# Altium schematic sheet Positive_Rail.SchDoc: Positive Rails
size 420 x 297 mm; CheckedBy: G.Kasprowicz; DrawnBy: M.Gaska; Address1: PW ISE; Address2: Nowowiejska 15/19 00-665 Warsaw; Address3: michalgaska2@gmail.com; DocumentNumber: 3; SheetNumber: 6; SheetTotal: 9; EDA_Number: ARTIQ; Projet: AUX PSU; ModifiedBy: M. Fafara; CheckedDate: -; Title2: v2.0; DivGrp: WUT ISE; Designer: M.Gaska
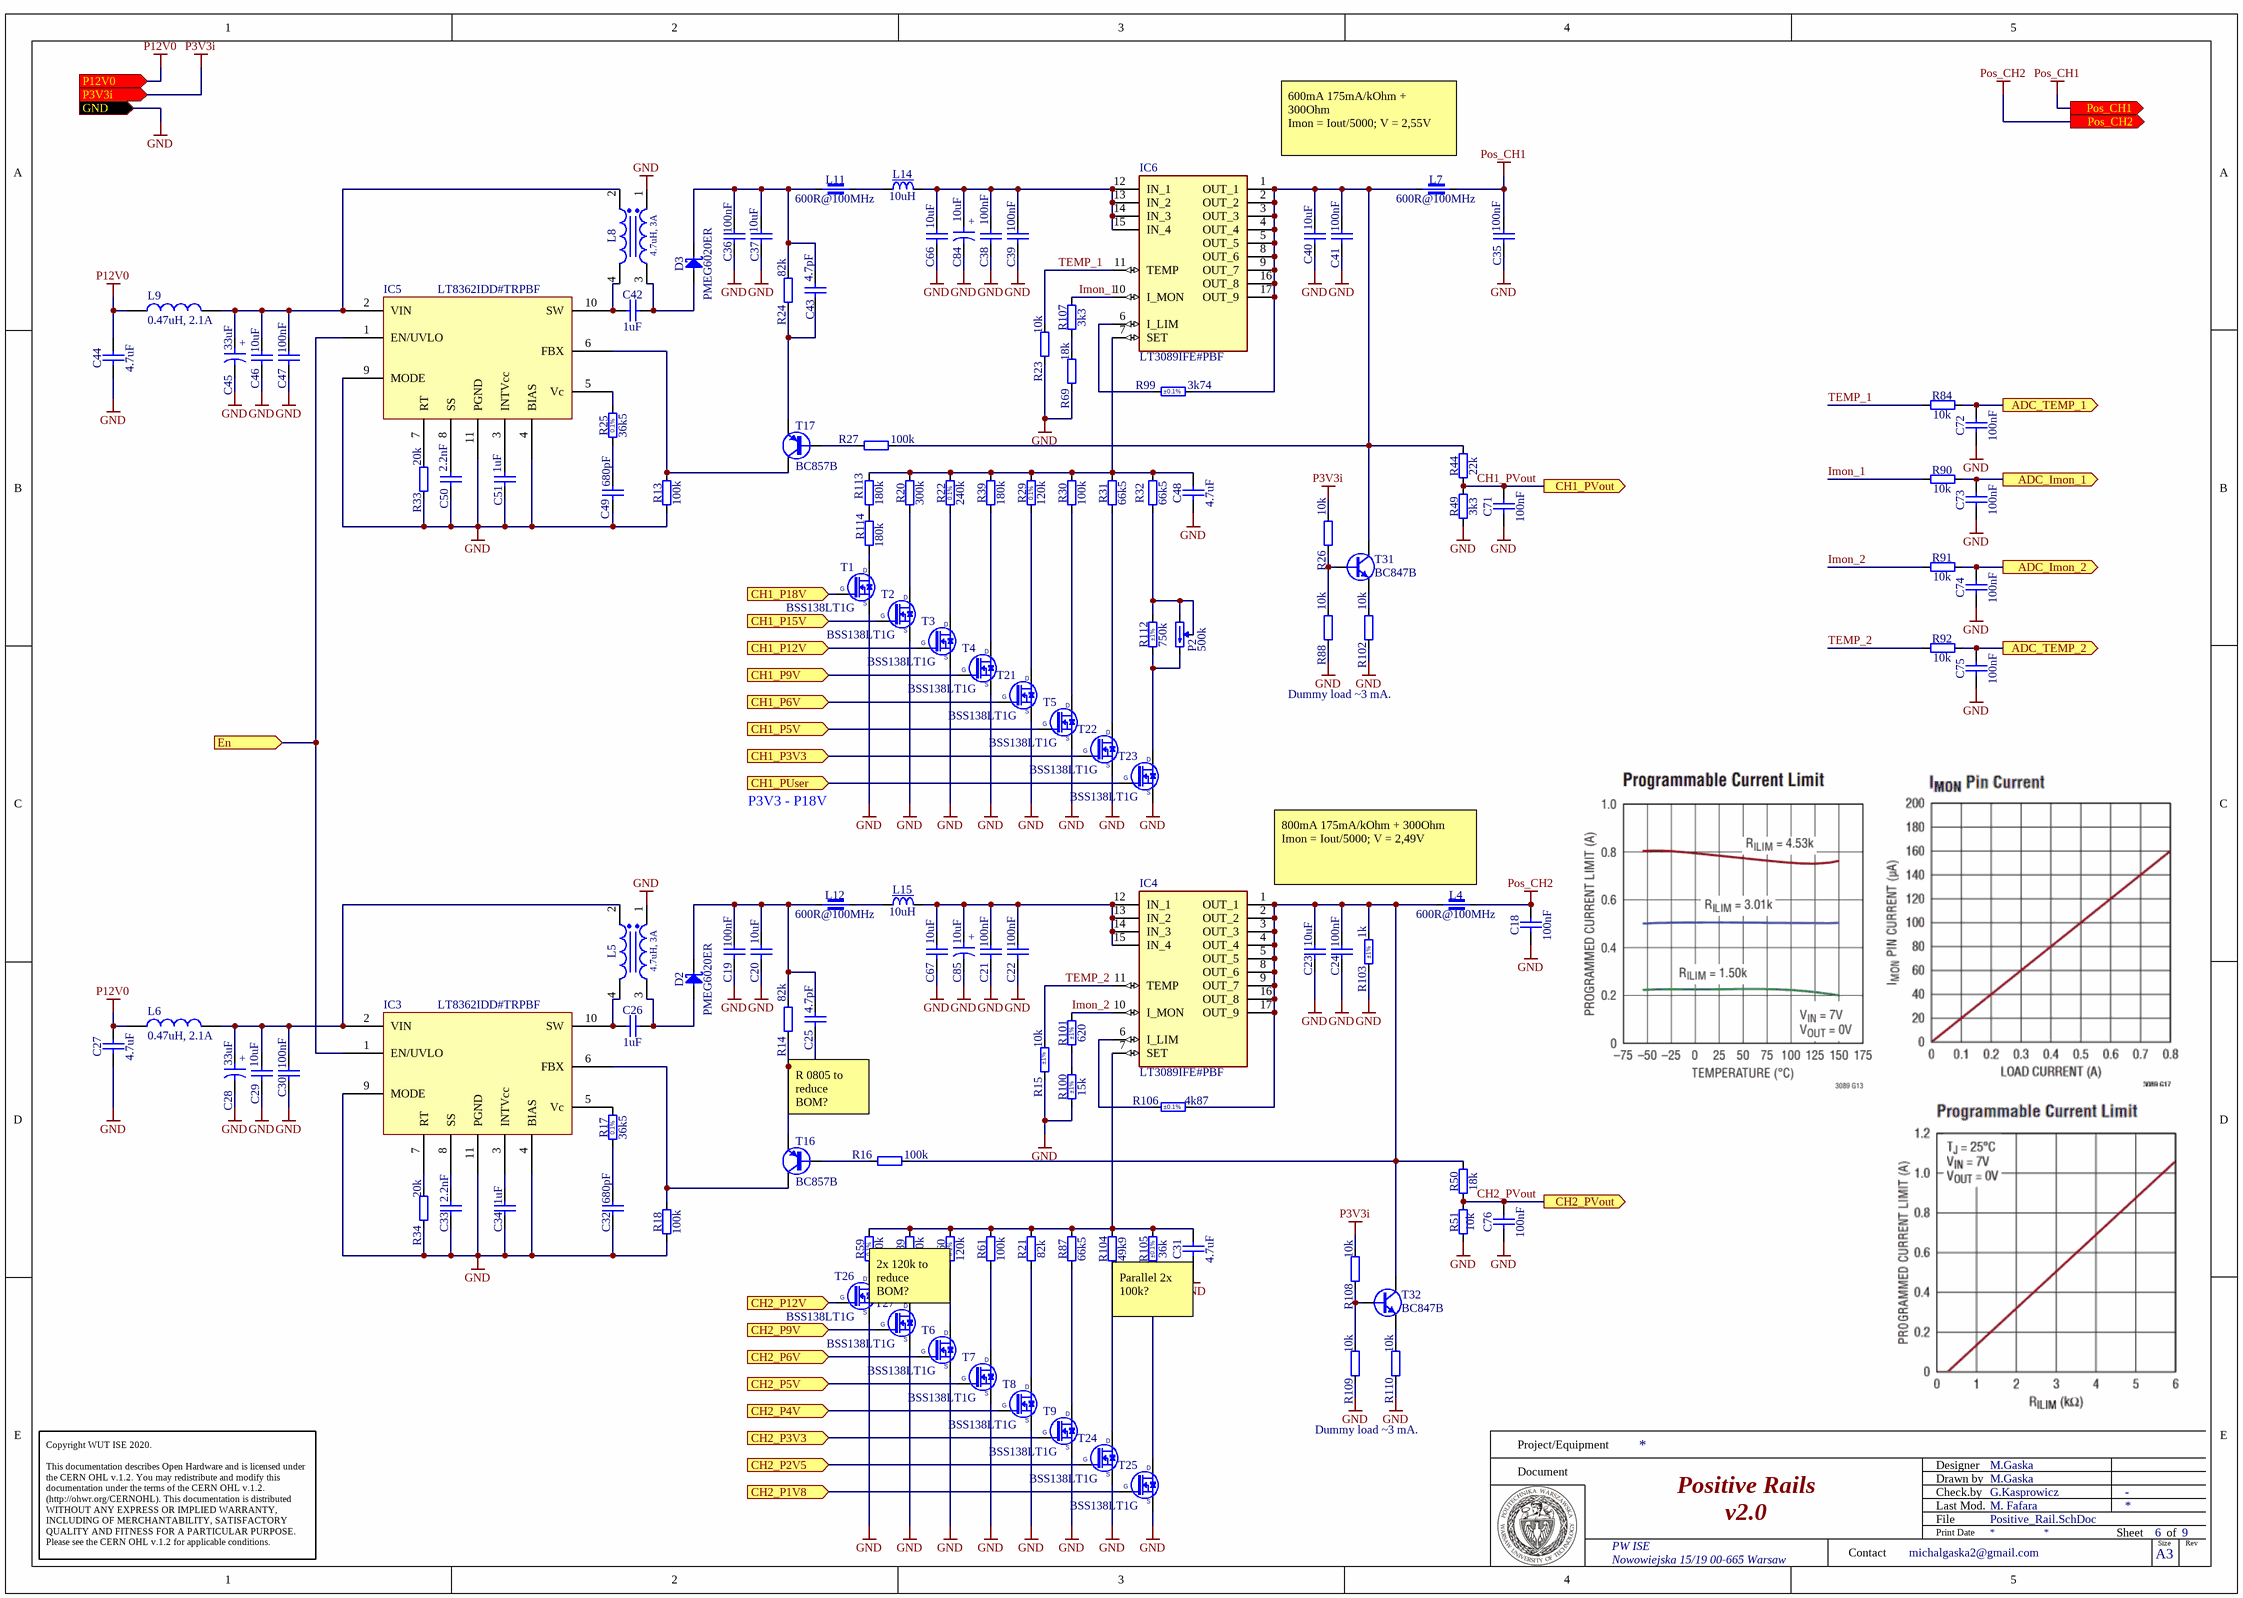
[diagram p0: Positive_Rail.SchDoc]

## Parts
C18  100nF  [CAPC1608X87N]
C19  100nF  [CAPC1608X87N]
C20  10uF  [CAPC3216X190N]
C21  100nF  [CAPC1608X87N]
C22  100nF  [CAPC1608X87N]
C23  10uF  [CAPC3216X190N]
C24  100nF  [CAPC1608X87N]
C25  4.7pF  [CAPC1608X87N]
C26  1uF  [CAPC3216X140N]
C27  4.7uF  [CAPC1608X90N]
C28  33uF  [CAPAE660X540N]
C29  10uF  [CAPC3216X190N]
C30  100nF  [CAPC1608X87N]
C31  4.7uF  [CAPC1608X90N]
C32  680pF  [CAPC1608X87N]
C33  2.2nF  [CAPC1005X55N]
C34  1uF  [CAPC1608X87N]
C35  100nF  [CAPC1608X87N]
C36  100nF  [CAPC1608X87N]
C37  10uF  [CAPC3216X190N]
C38  100nF  [CAPC1608X87N]
C39  100nF  [CAPC1608X87N]
C40  10uF  [CAPC3216X190N]
C41  100nF  [CAPC1608X87N]
C42  1uF  [CAPC3216X140N]
C43  4.7pF  [CAPC1608X87N]
C44  4.7uF  [CAPC1608X90N]
C45  33uF  [CAPAE660X540N]
C46  10uF  [CAPC3216X190N]
C47  100nF  [CAPC1608X87N]
C48  4.7uF  [CAPC1608X90N]
C49  680pF  [CAPC1608X87N]
C50  2.2nF  [CAPC1005X55N]
C51  1uF  [CAPC1608X87N]
C66  10uF  [CAPC3216X190N]
C67  10uF  [CAPC3216X190N]
C71  100nF  [CAPC1608X87N]
C72  100nF  [CAPC1608X87N]
C73  100nF  [CAPC1608X87N]
C74  100nF  [CAPC1608X87N]
C75  100nF  [CAPC1608X87N]
C76  100nF  [CAPC1608X87N]
C84  10uF  [CAPMP6032X280N]
C85  10uF  [CAPMP6032X280N]
D2  PMEG6020ER  [SODFL3517X110N]
D3  PMEG6020ER  [SODFL3517X110N]
IC3  LT8362IDD#TRPBF  [SON50P300X300X80-11N-R160X240]
IC4  LT3089IFE#PBF  [SOP65P640X110-17N]
IC5  LT8362IDD#TRPBF  [SON50P300X300X80-11N-R160X240]
IC6  LT3089IFE#PBF  [SOP65P640X110-17N]
L4  600R@100MHz  [INDC2012X110N]
L5  4.7uH, 3A  [WE-DD_1260]
L6  0.47uH, 2.1A  [WE-PMI_0806_H1]
L7  600R@100MHz  [INDC2012X110N]
L8  4.7uH, 3A  [WE-DD_1260]
L9  0.47uH, 2.1A  [WE-PMI_0806_H1]
L11  600R@100MHz  [INDC2012X110N]
L12  600R@100MHz  [INDC2012X110N]
L14  10uH  [IND_BOURNS_PM43]
L15  10uH  [IND_BOURNS_PM43]
P2  value 500k  [Bourns_3059Y]  (hidden comment: 3059Y-1-504LF)
R13  100k  [RESC1608X55N]
R14  82k  [RESC1608X55N]
R15  10k  Tolerance: ±1%  [RESC1608X55N]
R16  100k  [RESC1608X55N]
R17  36k5  [RESC1608X55N]
R18  100k  [RESC1608X55N]
R20  300k  [RESC2012X60N]
R21  82k  [RESC2012X60N]
R22  240k  [RESC2012X60N]
R23  10k  [RESC1608X55N]
R24  82k  [RESC1608X55N]
R25  36k5  [RESC1608X55N]
R26  10k  [RESC1608X55N]
R27  100k  [RESC1608X55N]
R29  120k  [RESC2012X60N]
R30  100k  [RESC2012X60N]
R31  66k5  [RESC2012X60N]
R32  66k5  [RESC2012X60N]
R33  20k  [RESC1608X55N]
R34  20k  [RESC1608X55N]
R39  180k  [RESC2012X60N]
R44  22k  [RESC1608X55N]
R49  3k3  [RESC1608X55N]
R50  18k  [RESC1608X55N]
R51  10k  [RESC1608X55N]
R59  240k  [RESC2012X60N]
R60  120k  [RESC2012X60N]
R61  100k  [RESC2012X60N]
R69  18k  [RESC1608X55N]
R84  10k  [RESC1608X55N]
R87  66k5  [RESC2012X60N]
R88  10k  [RESC1608X55N]
R89  180k  [RESC2012X60N]
R90  10k  [RESC1608X55N]
R91  10k  [RESC1608X55N]
R92  10k  [RESC1608X55N]
R99  3k74  Tolerance: ±0.1%  [RESC1608X55N]
R100  15k  Tolerance: ±1%  [RESC1608X55N]
R101  620  Tolerance: ±1%  [RESC1608X55N]
R102  10k  [RESC1608X55N]
R103  1k  Tolerance: ±1%  [RESC3216X65N]
R104  49k9  [RESC2012X60N]
R105  36k  Tolerance: ±0.1%  [RESC2012X60N]
R106  4k87  Tolerance: ±0.1%  [RESC1608X55N]
R107  3k3  [RESC1608X55N]
R108  10k  [RESC1608X55N]
R109  10k  [RESC1608X55N]
R110  10k  [RESC1608X55N]
R112  750k  Tolerance: ±1%  [RESC2012X60N]
R113  180k  [RESC2012X60N]
R114  180k  [RESC2012X60N]
T1  BSS138LT1G  [SOT95P240X110-3N]
T2  BSS138LT1G  [SOT95P240X110-3N]
T3  BSS138LT1G  [SOT95P240X110-3N]
T4  BSS138LT1G  [SOT95P240X110-3N]
T5  BSS138LT1G  [SOT95P240X110-3N]
T6  BSS138LT1G  [SOT95P240X110-3N]
T7  BSS138LT1G  [SOT95P240X110-3N]
T8  BSS138LT1G  [SOT95P240X110-3N]
T9  BSS138LT1G  [SOT95P240X110-3N]
T16  BC857B  [SOT95P230X110-3N]
T17  BC857B  [SOT95P230X110-3N]
T21  BSS138LT1G  [SOT95P240X110-3N]
T22  BSS138LT1G  [SOT95P240X110-3N]
T23  BSS138LT1G  [SOT95P240X110-3N]
T24  BSS138LT1G  [SOT95P240X110-3N]
T25  BSS138LT1G  [SOT95P240X110-3N]
T26  BSS138LT1G  [SOT95P240X110-3N]
T27  BSS138LT1G  [SOT95P240X110-3N]
T31  BC847B  [SOT95P230X110-3N]
T32  BC847B  [SOT95P230X110-3N]

## Ports
ADC_Imon_1 (out), ADC_Imon_2 (out), ADC_TEMP_1 (out), ADC_TEMP_2 (out), CH1_P3V3 (in), CH1_P5V (in), CH1_P6V (in), CH1_P9V (in), CH1_P12V (in), CH1_P15V (in), CH1_P18V (in), CH1_PUser (in), CH1_PVout (out), CH2_P1V8 (in), CH2_P2V5 (in), CH2_P3V3 (in), CH2_P4V (in), CH2_P5V (in), CH2_P6V (in), CH2_P9V (in), CH2_P12V (in), CH2_PVout (out), En (in), GND (in), P3V3i (in), P12V0 (in), Pos_CH1 (out), Pos_CH2 (out)

## Nets
GND: C18.1 C19.1 C20.1 C21.1 C22.1 C23.1 C24.1 C27.1 C28.2 C29.1 C30.1 C31.1 C32.1 C33.1 C34.1 C35.1 C36.1 C37.1 C38.1 C39.1 C40.1 C41.1 C44.1 C45.2 C46.1 C47.1 C48.1 C49.1 C50.1 C51.1 C66.1 C67.1 C71.1 C72.1 C73.1 C74.1 C75.1 C76.1 C84.2 C85.2 IC3.4(BIAS) IC3.9(MODE) IC3.11(PGND) IC5.4(BIAS) IC5.9(MODE) IC5.11(PGND) L5.1 L8.1 R13.1 R15.1 R18.1 R23.1 R33.1 R34.1 R49.1 R51.1 R69.1 R88.1 R100.1 R102.1 R103.1 R109.1 R110.1 T1.2(S) T2.2(S) T3.2(S) T4.2(S) T5.2(S) T6.2(S) T7.2(S) T8.2(S) T9.2(S) T21.2(S) T22.2(S) T23.2(S) T24.2(S) T25.2(S) T26.2(S) T27.2(S) ; port GND
P3V3i: R26.2 R108.2 ; port P3V3i
P12V0: C27.2 C44.2 L6.1 L9.1 ; port P12V0
Pos_CH1: C35.2 L7.2 ; port Pos_CH1
Pos_CH2: C18.2 L4.2 ; port Pos_CH2
ADC_Imon_1: C73.2 R90.2 ; port ADC_Imon_1
ADC_Imon_2: C74.2 R91.2 ; port ADC_Imon_2
ADC_TEMP_1: C72.2 R84.2 ; port ADC_TEMP_1
ADC_TEMP_2: C75.2 R92.2 ; port ADC_TEMP_2
CH1_P3V3: T22.1(G) ; port CH1_P3V3
CH1_P5V: T5.1(G) ; port CH1_P5V
CH1_P6V: T21.1(G) ; port CH1_P6V
CH1_P9V: T4.1(G) ; port CH1_P9V
CH1_P12V: T3.1(G) ; port CH1_P12V
CH1_P15V: T2.1(G) ; port CH1_P15V
CH1_P18V: T1.1(G) ; port CH1_P18V
CH1_PUser: T23.1(G) ; port CH1_PUser
CH1_PVout: C71.2 R44.1 R49.2 ; port CH1_PVout
CH2_P1V8: T25.1(G) ; port CH2_P1V8
CH2_P2V5: T24.1(G) ; port CH2_P2V5
CH2_P3V3: T9.1(G) ; port CH2_P3V3
CH2_P4V: T8.1(G) ; port CH2_P4V
CH2_P5V: T7.1(G) ; port CH2_P5V
CH2_P6V: T6.1(G) ; port CH2_P6V
CH2_P9V: T27.1(G) ; port CH2_P9V
CH2_P12V: T26.1(G) ; port CH2_P12V
CH2_PVout: C76.2 R50.1 R51.2 ; port CH2_PVout
En: IC3.1(EN/UVLO) IC5.1(EN/UVLO) ; port En
Imon_1: IC6.10(I_MON) R90.1 R107.2
Imon_2: IC4.10(I_MON) R91.1 R101.2
TEMP_1: IC6.11(TEMP) R23.2 R84.1
TEMP_2: IC4.11(TEMP) R15.2 R92.1
NetC19_2: C19.2 C20.2 C25.2 D2.1(C) L12.1 R14.2
NetC21_2: C21.2 C22.2 C67.2 C85.1 IC4.12(IN_1) IC4.13(IN_2) IC4.14(IN_3) IC4.15(IN_4) L15.2
NetC23_2: C23.2 C24.2 IC4.1(OUT_1) IC4.2(OUT_2) IC4.3(OUT_3) IC4.4(OUT_4) IC4.5(OUT_5) IC4.8(OUT_6) IC4.9(OUT_7) IC4.16(OUT_8) IC4.17(OUT_9) L4.1 R16.2 R50.2 R103.2 R106.2 T32.3(C)
NetC25_1: C25.1 R14.1 T16.2(E)
NetC26_1: C26.1 IC3.10(SW) L5.4
NetC26_2: C26.2 D2.2(A) L5.3
NetC28_1: C28.1 C29.2 C30.2 IC3.2(VIN) L5.2 L6.2
NetC31_2: C31.2 IC4.7(SET) R21.2 R59.2 R60.2 R61.2 R87.2 R89.2 R104.2 R105.2
NetC32_2: C32.2 R17.1
NetC33_2: C33.2 IC3.8(SS)
NetC34_2: C34.2 IC3.3(INTVcc)
NetC36_2: C36.2 C37.2 C43.2 D3.1(C) L11.1 R24.2
NetC38_2: C38.2 C39.2 C66.2 C84.1 IC6.12(IN_1) IC6.13(IN_2) IC6.14(IN_3) IC6.15(IN_4) L14.2
NetC40_2: C40.2 C41.2 IC6.1(OUT_1) IC6.2(OUT_2) IC6.3(OUT_3) IC6.4(OUT_4) IC6.5(OUT_5) IC6.8(OUT_6) IC6.9(OUT_7) IC6.16(OUT_8) IC6.17(OUT_9) L7.1 R27.2 R44.2 R99.2 T31.3(C)
NetC42_1: C42.1 IC5.10(SW) L8.4
NetC42_2: C42.2 D3.2(A) L8.3
NetC43_1: C43.1 R24.1 T17.2(E)
NetC45_1: C45.1 C46.2 C47.2 IC5.2(VIN) L8.2 L9.2
NetC48_2: C48.2 IC6.7(SET) R20.2 R22.2 R29.2 R30.2 R31.2 R32.2 R39.2 R113.2
NetC49_2: C49.2 R25.1
NetC50_2: C50.2 IC5.8(SS)
NetC51_2: C51.2 IC5.3(INTVcc)
NetIC3_5: IC3.5(Vc) R17.2
NetIC3_6: IC3.6(FBX) R18.2 T16.3(C)
NetIC3_7: IC3.7(RT) R34.2
NetIC4_6: IC4.6(I_LIM) R106.1
NetIC5_5: IC5.5(Vc) R25.2
NetIC5_6: IC5.6(FBX) R13.2 T17.3(C)
NetIC5_7: IC5.7(RT) R33.2
NetIC6_6: IC6.6(I_LIM) R99.1
NetL11_2: L11.2 L14.1
NetL12_2: L12.2 L15.1
NetP2_1: P2.1(CCW) P2.2(W) R32.1 R112.2
NetP2_3: P2.3(CW) R112.1 T23.3(D)
NetR16_1: R16.1 T16.1(B)
NetR20_1: R20.1 T2.3(D)
NetR21_1: R21.1 T8.3(D)
NetR22_1: R22.1 T3.3(D)
NetR26_1: R26.1 R88.2 T31.1(B)
NetR27_1: R27.1 T17.1(B)
NetR29_1: R29.1 T21.3(D)
NetR30_1: R30.1 T5.3(D)
NetR31_1: R31.1 T22.3(D)
NetR39_1: R39.1 T4.3(D)
NetR59_1: R59.1 T26.3(D)
NetR60_1: R60.1 T6.3(D)
NetR61_1: R61.1 T7.3(D)
NetR69_2: R69.2 R107.1
NetR87_1: R87.1 T9.3(D)
NetR89_1: R89.1 T27.3(D)
NetR100_2: R100.2 R101.1
NetR102_2: R102.2 T31.2(E)
NetR104_1: R104.1 T24.3(D)
NetR105_1: R105.1 T25.3(D)
NetR108_1: R108.1 R109.2 T32.1(B)
NetR110_2: R110.2 T32.2(E)
NetR113_1: R113.1 R114.1
NetR114_2: R114.2 T1.3(D)

## Notes on the sheet
- 600mA 175mA/kOhm + 300Ohm
  Imon = Iout/5000; V = 2,55V
- Dummy load ~3 mA.
- P3V3 - P18V
- 800mA 175mA/kOhm + 300Ohm
  Imon = Iout/5000; V = 2,49V
- R 0805 to reduce BOM?
- 2x 120k to reduce BOM?
- Parallel 2x 100k?
- Project/Equipment
- Document
- Designer
- Drawn by
- Check.by
- Copyright WUT ISE 2020.
  This documentation describes Open Hardware and is licensed under the CERN OHL v.1.2. You may redistribute and modify this documentation under the terms of the CERN OHL v.1.2. (http://ohwr.org/CERNOHL). This documentation is distributed WITHOUT ANY EXPRESS OR IMPLIED WARRANTY, INCLUDING OF MERCHANTABILITY, SATISFACTORY QUALITY AND FITNESS FOR A PARTICULAR PURPOSE. Please see the CERN OHL v.1.2 for applicable conditions.
- Contact
- File
- Last Mod.
- Print Date
- Sheet
- Size
- A3
- of
- Rev
- (in symbol CAE660-540_33UF_35V_20%) +
- (in symbol CTE6032-28_10UF_25V_10%_LESR0500) +
- (in symbol R0603_36K5_0.1%_0.063W_10PPM) 0.1%
- (in symbol R0805_120K_0.1%_0.125W_25PPM) 0.1%
- (in symbol R0805_240K_0.1%_0.1W_10PPM) 0.1%

## Library data of the parts
C18 C19 C21 C22 C24 C30 C35 C36 C38 C39 C41 C47 C71-C76 = CC0603_100NF_50V_10%_X5R: Non-polarised capacitor; Part Description: SMD Multilayer Chip Ceramic Capacitor; Manufacturer: GENERIC; Manufacturer1 Part Number: C1608X5R1H104K080; Voltage: 50V; TC: X5R; Tolerance: ±10%; Part Number: CC0603_100NF_50V_10%_X5R; Component Kind: Standard; Component Type: Standard; Pin Count: 2; Value: 100nF; Status: None; Manufacturer Part Number: CC0603_100NF_50V_10%_X5R; Case: 0603; Mounted: Yes; Socket: No; SMD: Yes; Sense: No; Manufacturer1 Example: TDK; Manufacturer1 ComponentHeight: 0.9mm; HelpURL: \\cern.ch\dfs\Applications\Altium\Datasheets\CC0603_X5R_TDK_C.pdf; Author: CERN DEM MR; CreateDate: 08.01.2016; LatestRevisionDate: 08.01.2016
C20 C23 C29 C37 C40 C46 C66 C67 = CC1206_10UF_35V_10%_X7R_YUDEN_GMJ316BB7106KLHT: Non-polarised capacitor; Part Description: Soft Termination SMD Multilayer Chip Ceramic Capacitor for Automotive / Industrial Applications; Manufacturer: TAIYO YUDEN; Voltage: 35V; TC: X7R; Tolerance: ±10%; Status Comment: for Not Designs; Part Number: CC1206_10UF_35V_10%_X7R_YUDEN_GMJ316BB7106KLHT; Component Kind: Standard; Component Type: Standard; Pin Count: 2; Value: 10uF; Status: Not Recommended; Manufacturer Part Number: GMJ316BB7106KLHT; Case: 1206; Mounted: Yes; Socket: No; SMD: Yes; Sense: No; ComponentHeight: 1.90mm; HelpURL: \\cern.ch\dfs\Applications\Altium\Datasheets\CC1206_TAIYO-YUDEN_GMJ316BB7106KLHT.pdf; Author: CERN DEM BC; CreateDate: 26.02.2016; LatestRevisionDate: 17.12.2018
C25 C43 = CC0603_4.7PF_50V_0.25PF_NP0: Non-polarised capacitor; Part Description: SMD Multilayer Chip Ceramic Capacitor; Manufacturer: GENERIC; Manufacturer1 Part Number: 223886715478; Voltage: 50V; TC: C0G/NP0; Tolerance: ±0.25pF; Part Number: CC0603_4.7PF_50V_0.25PF_NP0; Component Kind: Standard; Component Type: Standard; Pin Count: 2; Value: 4.7pF; Status: Preferred; Manufacturer Part Number: CC0603_4.7PF_50V_0.25PF_NP0; Case: 0603; Mounted: Yes; Socket: No; SMD: Yes; Sense: No; Manufacturer1 Example: PHYCOMP; Manufacturer1 ComponentHeight: 0.87mm; HelpURL: \\cern.ch\dfs\Applications\Altium\Datasheets\CC0603_NP0_PHYCOMP.pdf; Author: CERN DEM JLC; CreateDate: 03.12.2007; LatestRevisionDate: 03.12.2007
C26 C42 = CC1206_1UF_100V_10%_X7R: Non-polarised capacitor; Part Description: SMD Multilayer Chip Ceramic Capacitor; Manufacturer: GENERIC; Manufacturer1 Part Number: C1206C105K1RAC; Voltage: 100V; TC: X7R; Tolerance: ±10%; Part Number: CC1206_1UF_100V_10%_X7R; Component Kind: Standard; Component Type: Standard; Pin Count: 2; Value: 1uF; Status: Preferred; Manufacturer Part Number: CC1206_1UF_100V_10%_X7R; Case: 1206; Mounted: Yes; Socket: No; SMD: Yes; Sense: No; Manufacturer1 Example: KEMET; Manufacturer1 ComponentHeight: 1.8mm; HelpURL: \\cern.ch\dfs\Applications\Altium\Datasheets\CC1206_X7R_KEMET_OPENMODE.pdf; Author: CERN DEM BC; CreateDate: 24.01.2020; LatestRevisionDate: 24.01.2020
C27 C31 C44 C48 = CC0603_4.7UF_25V_10%_X5R: Non-polarised capacitor; Part Description: SMD Multilayer Chip Ceramic Capacitor; Manufacturer: GENERIC; Manufacturer1 Part Number: GRM188R61E475KE11D; Voltage: 25V; TC: X5R; Tolerance: ±10%; Part Number: CC0603_4.7UF_25V_10%_X5R; Component Kind: Standard; Component Type: Standard; Pin Count: 2; Value: 4.7uF; Status: None; Manufacturer Part Number: CC0603_4.7UF_25V_10%_X5R; Case: 0603; Mounted: Yes; Socket: No; SMD: Yes; Sense: No; Manufacturer1 Example: MURATA; Manufacturer1 ComponentHeight: 0.95mm; HelpURL: \\cern.ch\dfs\Applications\Altium\Datasheets\CC0603_MURATA_GRM188R61E475KE11D.pdf; Author: CERN DEM JLC; CreateDate: 10.11.2014; LatestRevisionDate: 10.11.2014
C28 C45 = CAE660-540_33UF_35V_20%: Polarised capacitor; Part Description: Aluminum Electrolytic SMT Capacitor; Manufacturer: PANASONIC; Manufacturer Part Number: EEEFK1V330AP; Voltage: 35V; Tolerance: ±20%; Part Number: CAE660-540_33UF_35V_20%; Component Kind: Standard; Component Type: Standard; Pin Count: 2; Value: 33uF; Status: Not Recommended; Case: D; Mounted: Yes; Socket: No; SMD: Yes; Sense: No; ComponentHeight: 5.8mm; HelpURL: \\cern.ch\dfs\Applications\Altium\Datasheets\CAE_PANASONIC_FK-V.pdf; Author: CERN DEM JLC; CreateDate: 03.12.2007; LatestRevisionDate: 05.11.2014
C32 C49 = CC0603_680PF_50V_5%_NP0: Non-polarised capacitor; Part Description: SMD Multilayer Chip Ceramic Capacitor; Manufacturer: GENERIC; Manufacturer1 Part Number: 223886715681; Voltage: 50V; TC: C0G/NP0; Tolerance: ±5%; Part Number: CC0603_680PF_50V_5%_NP0; Component Kind: Standard; Component Type: Standard; Pin Count: 2; Value: 680pF; Status: Preferred; Manufacturer Part Number: CC0603_680PF_50V_5%_NP0; Case: 0603; Mounted: Yes; Socket: No; SMD: Yes; Sense: No; Manufacturer1 Example: PHYCOMP; Manufacturer1 ComponentHeight: 0.87mm; HelpURL: \\cern.ch\dfs\Applications\Altium\Datasheets\CC0603_NP0_PHYCOMP.pdf; Author: CERN DEM JLC; CreateDate: 03.12.2007; LatestRevisionDate: 03.12.2007
C33 C50 = CC0402_2.2NF_50V_10%_X7R: Non-polarised capacitor; Part Description: SMD Multilayer Chip Ceramic Capacitor; Manufacturer: GENERIC; Manufacturer1 Part Number: 223858715627; Voltage: 50V; TC: X7R; Tolerance: ±10%; Part Number: CC0402_2.2NF_50V_10%_X7R; Component Kind: Standard; Component Type: Standard; Pin Count: 2; Value: 2.2nF; Status: Not Recommended; Manufacturer Part Number: CC0402_2.2NF_50V_10%_X7R; Case: 0402; Mounted: Yes; Socket: No; SMD: Yes; Sense: No; Manufacturer1 Example: PHYCOMP; Manufacturer1 ComponentHeight: 0.55mm; HelpURL: \\cern.ch\dfs\Applications\Altium\Datasheets\CC0402_X7R_PHYCOMP.pdf; Author: CERN DEM JLC; CreateDate: 03.12.2007; LatestRevisionDate: 03.12.2007
C34 C51 = CC0603_1UF_16V_10%_X7R: Non-polarised capacitor; Part Description: SMD Multilayer Chip Ceramic Capacitor; Manufacturer: GENERIC; Manufacturer1 Part Number: 223878615663; Voltage: 16V; TC: X7R; Tolerance: ±10%; Part Number: CC0603_1UF_16V_10%_X7R; Component Kind: Standard; Component Type: Standard; Pin Count: 2; Value: 1uF; Status: None; Manufacturer Part Number: CC0603_1uF_16V_10%_X7R; Case: 0603; Mounted: Yes; Socket: No; SMD: Yes; Sense: No; Manufacturer1 Example: YAGEO PHYCOMP; Manufacturer1 ComponentHeight: 0.9mm; HelpURL: \\cern.ch\dfs\Applications\Altium\Datasheets\CC0603_X7R_PHYCOMP.pdf; Author: CERN DEM JLC; CreateDate: 03.12.2007; LatestRevisionDate: 17.04.2015
C84 C85 = CTE6032-28_10UF_25V_10%_LESR0500: Polarised capacitor; Part Description: Low ESR 0R5 Solid Tantalum Chip Capacitor; Manufacturer: GENERIC; Manufacturer1 Part Number: TPSC106K025R0500; Voltage: 25V; Tolerance: ±10%; Part Number: CTE6032-28_10UF_25V_10%_LESR0500; Component Kind: Standard; Component Type: Standard; Pin Count: 2; Value: 10uF; Status: Preferred; Manufacturer Part Number: CTE6032-28_10UF_25V_10%_LESR0500; Case: C; Mounted: Yes; Socket: No; SMD: Yes; Sense: No; Manufacturer1 Example: AVX; Manufacturer1 ComponentHeight: 2.8mm; HelpURL: \\cern.ch\dfs\Applications\Altium\Datasheets\CTE-LESR_AVX_TPS.pdf; Author: CERN DEM JLC; CreateDate: 05.05.2008; LatestRevisionDate: 20.01.2009
D2 D3 = PMEG6020ER: Schottky Diode; Part Description: MEGA Schottky Barrier Rectifier; Manufacturer: NXP SEMICONDUCTORS; Voltage: 60V; Power: 2A; PressFit: No; Bonding: No; Part Number: PMEG6020ER; Component Kind: Standard; Component Type: Standard; Device: PMEG6020ER; PackageDescription: SODFL Diode (SOD123W); 2.60mm W X 1.70mm L X 1.10mm H body, IPC Medium Density; Manufacturer Part Number: PMEG6020ER; Pin Count: 2; Case: SOD-123FL; Mounted: Yes; Socket: No; SMD: Yes; Sense: No; ComponentHeight: 1.1mm; HelpURL: \\cern.ch\dfs\Applications\Altium\Datasheets\PMEG6020ER.pdf; Author: CERN DEM JMW; CreateDate: 19.06.2014; LatestRevisionDate: 19.06.2014
IC4 IC6 = LT3089IFE#PBF: LDO Voltage Regulators 800mA 1x Res Rugged Lin Reg w/ Mon s; Manufacturer_Name: Analog Devices; Datasheet Link: https://datasheet.datasheetarchive.com/originals/distributors/DKDS-14/269811.pdf; Height: 1.1mm; Manufacturer Part Number: LT3089IFE#PBF; Mouser Part Number: 584-LT3089IFE#PBF; Mouser Price/Stock: https://www.mouser.co.uk/ProductDetail/Analog-Devices/LT3089IFEPBF?qs=oahfZPh6IAJK75iHT%252BsZQw%3D%3D; Arrow Part Number: LT3089IFE#PBF; Arrow Price/Stock: https://www.arrow.com/en/products/lt3089ifepbf/analog-devices?region=europe
L4 L7 L11 L12 = IND0805_WURTH_742792040: Part Description: SMD EMI Suppression Chip Ferrite Bead (WE-CBF Series); Manufacturer: WURTH ELEKTRONIK; Power: 2A; Resistance: 0.150R; Tolerance: ±25%; Part Number: IND0805_WURTH_742792040; Component Kind: Standard; Component Type: Standard; Pin Count: 2; Value: 600R@100MHz; Manufacturer Part Number: 742792040; Case: 0805; Mounted: Yes; Socket: No; SMD: Yes; Sense: No; ComponentHeight: 1.1mm; HelpURL: \\cern.ch\dfs\Applications\Altium\Datasheets\IND0805_WURTH_742792040.pdf; Author: CERN DEM JLC; CreateDate: 10.05.2010; LatestRevisionDate: 25.10.2018
L5 L8 = 744871004: WE-DD SMT Shielded Coupled Inductor, size 1260, 4.7uH, 3A; Manufacturer: Wurth Elektronik; Rated Voltage: 80V; DC Resistance max.: 28mOhm; Self Resonant Frequency: 20MHz; DC Resistance typ.: 23mOhm; Saturation Current: 8A; Turns Ratio: 1:1; Type: Crossed; ComponentLink1Description: Manufacturer; ComponentLink1URL: http://www.we-online.de; ComponentLink2Description: Datasheet; ComponentLink2URL: https://www.we-online.com/catalog/datasheet/744871004.pdf; Packaging: Tape and Reel; Published Date: April 2020; Rated Current: 3A; Operating Temperature: -40 to +125degC; Size: 1260; Inductance: 4.7uH; Mounting Technology: SMT; Manufacturer Part Number: 744871004
L6 L9 = 74479876147: WE-PMI Power Multilayer Inductor, size 0806, 0.47uH, 2.1A; Manufacturer: Wurth Elektronik; Q-Factor: 13; Saturation Current: 2A; DC Resistance max.: 50mOhm; Inductance Tolerance: +/-20%; Rated Current @20K: 1.5A; Self Resonant Frequency: 120MHz; Type: Low RDC & High Saturation Current; ComponentLink1Description: Manufacturer; ComponentLink1URL: http://www.we-online.de; ComponentLink2Description: Datasheet; ComponentLink2URL: https://www.we-online.com/catalog/datasheet/74479876147.pdf; Mounting Technology: SMT; Operating Temperature: -40 to +125degC; Packaging: Tape and Reel; Inductance: 0.47uH; Rated Current @40K: 2.1A; Manufacturer Part Number: 74479876147; Published Date: April 2020; Size: 0806
L14 L15 = IND_10UH_20%_BOURNS_PM43: Inductor With Core; Part Description: SMD Power Inductor; Manufacturer: BOURNS; Manufacturer Part Number: PM43-100M-RC; Power: 1.15A; Resistance: 0.18R; Tolerance: ±20%; Part Number: IND_10UH_20%_BOURNS_PM43; Component Kind: Standard; Component Type: Standard; Pin Count: 2; Value: 10uH; Mounted: Yes; Socket: No; SMD: Yes; Sense: No; ComponentHeight: 3.5mm; HelpURL: \\cern.ch\dfs\Applications\Altium\Datasheets\IND_BOURNS_PM43.pdf; Author: CERN DEM JLC; CreateDate: 17.05.2011; LatestRevisionDate: 17.05.2011
P2 = CMP-009-04017-1: Trimmer, Cermet, 1W, 500000ohm, 400V, 10% +/-Tol, 100ppm/Cel, 22 Turn(s); Mounting Technology: Through Hole; Max Operating Temperature: 150°C; RoHS Compliant: Yes; Min Operating Temperature: -55°C; Power: 1W; Pins: 3; Tolerance: 10%
R13 R16 R18 R27 = R0603_100K_1%_0.1W_100PPM: Resistor - 1%; Part Description: General Purpose Thick Film Chip Resistor; Manufacturer: GENERIC; Manufacturer1 Part Number: NRC06F1003TRF; Power: 0.1W; TC: ±100ppm/°C; PressFit: No; Part Number: R0603_100K_1%_0.1W_100PPM; Component Kind: Standard; Component Type: Standard; Pin Count: 2; Value: 100k; Status: Preferred; Tolerance: ±1%; Manufacturer Part Number: R0603_100K_1%_0.1W_100PPM; Case: 0603; Mounted: Yes; Sense: No; Socket: No; SMD: Yes; Manufacturer1 Example: NIC COMPONENT; Manufacturer1 ComponentHeight: 0.55mm; HelpURL: \\cern.ch\dfs\Applications\Altium\Datasheets\R0603_NIC_NRC.pdf; Author: CERN DEM JLC; CreateDate: 03.12.2007; LatestRevisionDate: 13.03.2008
R14 R24 = R0603_82K_1%_0.1W_100PPM: Resistor - 1%; Part Description: General Purpose Thick Film Chip Resistor; Manufacturer: GENERIC; Manufacturer1 Part Number: NRC06F8202TRF; Power: 0.1W; TC: ±100ppm/°C; PressFit: No; Part Number: R0603_82K_1%_0.1W_100PPM; Component Kind: Standard; Component Type: Standard; Pin Count: 2; Value: 82k; Status: Preferred; Tolerance: ±1%; Manufacturer Part Number: R0603_82K_1%_0.1W_100PPM; Case: 0603; Mounted: Yes; Sense: No; Socket: No; SMD: Yes; Manufacturer1 Example: NIC COMPONENT; Manufacturer1 ComponentHeight: 0.55mm; HelpURL: \\cern.ch\dfs\Applications\Altium\Datasheets\R0603_NIC_NRC.pdf; Author: CERN DEM JLC; CreateDate: 03.12.2007; LatestRevisionDate: 13.03.2008
R15 R23 R26 R51 R84 R88 R90-R92 R102 R108-R110 = R0603_10K_1%_0.1W_100PPM: Resistor - 1%; Part Description: General Purpose Thick Film Chip Resistor; Manufacturer: GENERIC; Manufacturer1 Part Number: NRC06F1002TRF; Power: 0.1W; TC: ±100ppm/°C; PressFit: No; Part Number: R0603_10K_1%_0.1W_100PPM; Component Kind: Standard; Component Type: Standard; Pin Count: 2; Value: 10k; Status: Preferred; Manufacturer Part Number: R0603_10K_1%_0.1W_100PPM; Case: 0603; Mounted: Yes; Sense: No; Socket: No; SMD: Yes; Manufacturer1 Example: NIC COMPONENT; Manufacturer1 ComponentHeight: 0.55mm; HelpURL: \\cern.ch\dfs\Applications\Altium\Datasheets\R0603_NIC_NRC.pdf; Author: CERN DEM JLC; CreateDate: 03.12.2007; LatestRevisionDate: 13.03.2008
  R23 R26 R51 R84 R88 R90-R92 R102 R108-R110: Tolerance: ±1%
R17 R25 = R0603_36K5_0.1%_0.063W_10PPM: Resistor - 0.1%; Part Description: Thin Film Chip Resistor; Manufacturer: GENERIC; Manufacturer1 Part Number: RN73C1J36K5BTDF; Power: 0.063W; TC: ±10ppm; PressFit: No; Part Number: R0603_36K5_0.1%_0.063W_10PPM; Component Kind: Standard; Component Type: Standard; Pin Count: 2; Value: 36k5; Status: Not Recommended; Tolerance: ±0.1%; Manufacturer Part Number: R0603_36K5_0.1%_0.063W_10PPM; Case: 0603; Mounted: Yes; Sense: No; Socket: No; SMD: Yes; Manufacturer1 Example: TYCO HOLSWORTHY; Manufacturer1 ComponentHeight: 0.5mm; HelpURL: \\cern.ch\dfs\Applications\Altium\Datasheets\R0603_Tyco_RN73.pdf; Author: CERN DEM JLC; CreateDate: 03.12.2007; LatestRevisionDate: 13.03.2008
R20 = R0805_300K_1%_0.125W_100PPM: Resistor - 1%; Part Description: General Purpose Thick Film Chip Resistor; Manufacturer: GENERIC; Manufacturer1 Part Number: NRC10F3003TRF; Power: 0.125W; TC: ±100ppm/°C; PressFit: No; Part Number: R0805_300K_1%_0.125W_100PPM; Component Kind: Standard; Component Type: Standard; Pin Count: 2; Value: 300k; Status: Preferred; Tolerance: ±1%; Manufacturer Part Number: R0805_300K_1%_0.125W_100PPM; Case: 0805; Mounted: Yes; Sense: No; Socket: No; SMD: Yes; Manufacturer1 Example: NIC COMPONENT; Manufacturer1 ComponentHeight: 0.6mm; HelpURL: \\cern.ch\dfs\Applications\Altium\Datasheets\R0805_NIC_NRC.pdf; Author: CERN DEM JLC; CreateDate: 03.12.2007; LatestRevisionDate: 13.03.2008
R21 = R0805_82K_1%_0.125W_100PPM: Resistor - 1%; Part Description: General Purpose Thick Film Chip Resistor; Manufacturer: GENERIC; Manufacturer1 Part Number: NRC10F8202TRF; Power: 0.125W; TC: ±100ppm/°C; PressFit: No; Part Number: R0805_82K_1%_0.125W_100PPM; Component Kind: Standard; Component Type: Standard; Pin Count: 2; Value: 82k; Status: Preferred; Tolerance: ±1%; Manufacturer Part Number: R0805_82K_1%_0.125W_100PPM; Case: 0805; Mounted: Yes; Sense: No; Socket: No; SMD: Yes; Manufacturer1 Example: NIC COMPONENT; Manufacturer1 ComponentHeight: 0.6mm; HelpURL: \\cern.ch\dfs\Applications\Altium\Datasheets\R0805_NIC_NRC.pdf; Author: CERN DEM JLC; CreateDate: 03.12.2007; LatestRevisionDate: 13.03.2008
R22 R59 = R0805_240K_0.1%_0.1W_10PPM: Resistor - 0.1%; Part Description: Thin Film Chip Resistor; Manufacturer: GENERIC; Manufacturer1 Part Number: RN73C2A240KBTG; Power: 0.1W; TC: ±10ppm; PressFit: No; Part Number: R0805_240K_0.1%_0.1W_10PPM; Component Kind: Standard; Component Type: Standard; Pin Count: 2; Value: 240k; Status: Not Recommended; Tolerance: ±0.1%; Manufacturer Part Number: R0805_240K_0.1%_0.1W_10PPM; Case: 0805; Mounted: Yes; Sense: No; Socket: No; SMD: Yes; Manufacturer1 Example: TYCO HOLSWORTHY; Manufacturer1 ComponentHeight: 0.6mm; HelpURL: \\cern.ch\dfs\Applications\Altium\Datasheets\R0805_Tyco_RN73.pdf; Author: CERN DEM JLC; CreateDate: 23.02.2015; LatestRevisionDate: 23.02.2015
R29 R60 = R0805_120K_0.1%_0.125W_25PPM: Resistor - 0.1%; Part Description: Thin Film Chip Resistor; Manufacturer: GENERIC; Manufacturer1 Part Number: ERA6AEB124V; Power: 0.125W; TC: ±25ppm; PressFit: No; Part Number: R0805_120K_0.1%_0.125W_25PPM; Component Kind: Standard; Component Type: Standard; Pin Count: 2; Value: 120k; Status: Not Recommended; Tolerance: ±0.1%; Manufacturer Part Number: R0805_120K_0.1%_0.125W_25PPM; Case: 0805; Mounted: Yes; Sense: No; Socket: No; SMD: Yes; Manufacturer1 Example: PANASONIC; Manufacturer1 ComponentHeight: 0.6mm; HelpURL: \\cern.ch\dfs\Applications\Altium\Datasheets\R0805_PANASONIC_ERA.pdf; Author: CERN DEM JLC; CreateDate: 04.06.2015; LatestRevisionDate: 04.06.2015
R30 R61 = R0805_100K_0.1%_0.1W_10PPM: Resistor - 0.1%; Part Description: Thin Film Chip Resistor; Manufacturer: GENERIC; Manufacturer1 Part Number: RN73C2A100KBTG; Power: 0.1W; TC: ±10ppm; PressFit: No; Part Number: R0805_100K_0.1%_0.1W_10PPM; Component Kind: Standard; Component Type: Standard; Pin Count: 2; Value: 100k; Status: Not Recommended; Tolerance: ±0.1%; Manufacturer Part Number: R0805_100K_0.1%_0.1W_10PPM; Case: 0805; Mounted: Yes; Sense: No; Socket: No; SMD: Yes; Manufacturer1 Example: TYCO HOLSWORTHY; Manufacturer1 ComponentHeight: 0.6mm; HelpURL: \\cern.ch\dfs\Applications\Altium\Datasheets\R0805_Tyco_RN73.pdf; Author: CERN DEM JLC; CreateDate: 03.12.2007; LatestRevisionDate: 13.03.2008
R31 R32 R87 = R0805_66K5_0.1%_0.1W_10PPM: Resistor - 0.1%; Part Description: Thin Film Chip Resistor; Manufacturer: GENERIC; Manufacturer1 Part Number: RN73C2A66K5BTG; Power: 0.1W; TC: ±10ppm; PressFit: No; Part Number: R0805_66K5_0.1%_0.1W_10PPM; Component Kind: Standard; Component Type: Standard; Pin Count: 2; Value: 66k5; Status: Not Recommended; Tolerance: ±0.1%; Manufacturer Part Number: R0805_66K5_0.1%_0.1W_10PPM; Case: 0805; Mounted: Yes; Sense: No; Socket: No; SMD: Yes; Manufacturer1 Example: TYCO HOLSWORTHY; Manufacturer1 ComponentHeight: 0.6mm; HelpURL: \\cern.ch\dfs\Applications\Altium\Datasheets\R0805_Tyco_RN73.pdf; Author: CERN DEM JLC; CreateDate: 03.12.2007; LatestRevisionDate: 13.03.2008
R33 R34 = R0603_20K_1%_0.1W_100PPM: Resistor - 1%; Part Description: General Purpose Thick Film Chip Resistor; Manufacturer: GENERIC; Manufacturer1 Part Number: NRC06F2002TRF; Power: 0.1W; TC: ±100ppm/°C; PressFit: No; Part Number: R0603_20K_1%_0.1W_100PPM; Component Kind: Standard; Component Type: Standard; Pin Count: 2; Value: 20k; Status: Preferred; Tolerance: ±1%; Manufacturer Part Number: R0603_20K_1%_0.1W_100PPM; Case: 0603; Mounted: Yes; Sense: No; Socket: No; SMD: Yes; Manufacturer1 Example: NIC COMPONENT; Manufacturer1 ComponentHeight: 0.55mm; HelpURL: \\cern.ch\dfs\Applications\Altium\Datasheets\R0603_NIC_NRC.pdf; Author: CERN DEM JLC; CreateDate: 03.12.2007; LatestRevisionDate: 13.03.2008
R39 R89 R113 R114 = R0805_180K_1%_0.125W_100PPM: Resistor - 1%; Part Description: General Purpose Thick Film Chip Resistor; Manufacturer: GENERIC; Manufacturer1 Part Number: NRC10F1803TRF; Power: 0.125W; TC: ±100ppm/°C; PressFit: No; Part Number: R0805_180K_1%_0.125W_100PPM; Component Kind: Standard; Component Type: Standard; Pin Count: 2; Value: 180k; Status: Preferred; Tolerance: ±1%; Manufacturer Part Number: R0805_180K_1%_0.125W_100PPM; Case: 0805; Mounted: Yes; Sense: No; Socket: No; SMD: Yes; Manufacturer1 Example: NIC COMPONENT; Manufacturer1 ComponentHeight: 0.6mm; HelpURL: \\cern.ch\dfs\Applications\Altium\Datasheets\R0805_NIC_NRC.pdf; Author: CERN DEM JLC; CreateDate: 03.12.2007; LatestRevisionDate: 13.03.2008
R44 = R0603_22K_1%_0.1W_100PPM: Resistor - 1%; Part Description: General Purpose Thick Film Chip Resistor; Manufacturer: GENERIC; Manufacturer1 Part Number: NRC06F2202TRF; Power: 0.1W; TC: ±100ppm/°C; PressFit: No; Part Number: R0603_22K_1%_0.1W_100PPM; Component Kind: Standard; Component Type: Standard; Pin Count: 2; Value: 22k; Status: Preferred; Tolerance: ±1%; Manufacturer Part Number: R0603_22K_1%_0.1W_100PPM; Case: 0603; Mounted: Yes; Sense: No; Socket: No; SMD: Yes; Manufacturer1 Example: NIC COMPONENT; Manufacturer1 ComponentHeight: 0.55mm; HelpURL: \\cern.ch\dfs\Applications\Altium\Datasheets\R0603_NIC_NRC.pdf; Author: CERN DEM JLC; CreateDate: 03.12.2007; LatestRevisionDate: 13.03.2008
R49 R107 = R0603_3K3_1%_0.1W_100PPM: Resistor - 1%; Part Description: General Purpose Thick Film Chip Resistor; Manufacturer: GENERIC; Manufacturer1 Part Number: NRC06F3301TRF; Power: 0.1W; TC: ±100ppm/°C; PressFit: No; Part Number: R0603_3K3_1%_0.1W_100PPM; Component Kind: Standard; Component Type: Standard; Pin Count: 2; Value: 3k3; Status: Preferred; Tolerance: ±1%; Manufacturer Part Number: R0603_3K3_1%_0.1W_100PPM; Case: 0603; Mounted: Yes; Sense: No; Socket: No; SMD: Yes; Manufacturer1 Example: NIC COMPONENT; Manufacturer1 ComponentHeight: 0.55mm; HelpURL: \\cern.ch\dfs\Applications\Altium\Datasheets\R0603_NIC_NRC.pdf; Author: CERN DEM JLC; CreateDate: 03.12.2007; LatestRevisionDate: 13.03.2008
R50 R69 = R0603_18K_1%_0.1W_100PPM: Resistor - 1%; Part Description: General Purpose Thick Film Chip Resistor; Manufacturer: GENERIC; Manufacturer1 Part Number: NRC06F1802TRF; Power: 0.1W; TC: ±100ppm/°C; PressFit: No; Part Number: R0603_18K_1%_0.1W_100PPM; Component Kind: Standard; Component Type: Standard; Pin Count: 2; Value: 18k; Status: Preferred; Tolerance: ±1%; Manufacturer Part Number: R0603_18K_1%_0.1W_100PPM; Case: 0603; Mounted: Yes; Sense: No; Socket: No; SMD: Yes; Manufacturer1 Example: NIC COMPONENT; Manufacturer1 ComponentHeight: 0.55mm; HelpURL: \\cern.ch\dfs\Applications\Altium\Datasheets\R0603_NIC_NRC.pdf; Author: CERN DEM JLC; CreateDate: 03.12.2007; LatestRevisionDate: 13.03.2008
R99 = R0603_3K74_0.1%_0.063W_10PPM: Resistor - 0.1%; Part Description: Thin Film Chip Resistor; Manufacturer: GENERIC; Manufacturer1 Part Number: RN73C1J3K74BTDF; Power: 0.063W; TC: ±10ppm; PressFit: No; Part Number: R0603_3K74_0.1%_0.063W_10PPM; Component Kind: Standard; Component Type: Standard; Pin Count: 2; Value: 3k74; Status: Not Recommended; Manufacturer Part Number: R0603_3K74_0.1%_0.063W_10PPM; Case: 0603; Mounted: Yes; Sense: No; Socket: No; SMD: Yes; Manufacturer1 Example: TYCO HOLSWORTHY; Manufacturer1 ComponentHeight: 0.5mm; HelpURL: \\cern.ch\dfs\Applications\Altium\Datasheets\R0603_Tyco_RN73.pdf; Author: CERN DEM JLC; CreateDate: 03.12.2007; LatestRevisionDate: 13.03.2008
R100 = R0603_15K_1%_0.1W_100PPM: Resistor - 1%; Part Description: General Purpose Thick Film Chip Resistor; Manufacturer: GENERIC; Manufacturer1 Part Number: NRC06F1502TRF; Power: 0.1W; TC: ±100ppm/°C; PressFit: No; Part Number: R0603_15K_1%_0.1W_100PPM; Component Kind: Standard; Component Type: Standard; Pin Count: 2; Value: 15k; Status: Preferred; Manufacturer Part Number: R0603_15K_1%_0.1W_100PPM; Case: 0603; Mounted: Yes; Sense: No; Socket: No; SMD: Yes; Manufacturer1 Example: NIC COMPONENT; Manufacturer1 ComponentHeight: 0.55mm; HelpURL: \\cern.ch\dfs\Applications\Altium\Datasheets\R0603_NIC_NRC.pdf; Author: CERN DEM JMW; CreateDate: 17.08.2015; LatestRevisionDate: 17.08.2015
R101 = R0603_620R_1%_0.1W_100PPM: Resistor - 1%; Part Description: General Purpose Thick Film Chip Resistor; Manufacturer: GENERIC; Manufacturer1 Part Number: NRC06F6200TRF; Power: 0.1W; TC: ±100ppm/°C; PressFit: No; Part Number: R0603_620R_1%_0.1W_100PPM; Component Kind: Standard; Component Type: Standard; Pin Count: 2; Value: 620; Status: Preferred; Manufacturer Part Number: R0603_620R_1%_0.1W_100PPM; Case: 0603; Mounted: Yes; Sense: No; Socket: No; SMD: Yes; Manufacturer1 Example: NIC COMPONENT; Manufacturer1 ComponentHeight: 0.55mm; HelpURL: \\cern.ch\dfs\Applications\Altium\Datasheets\R0603_NIC_NRC.pdf; Author: CERN DEM JLC; CreateDate: 03.12.2007; LatestRevisionDate: 13.03.2008
R103 = R1206_1K_1%_0.75W_100PPM_VISHAY_CRCW-HP e3: Resistor - 1%; Part Description: Pulse Proof, High Power Thick Film Chip Resistor; Manufacturer: VISHAY DRALORIC; Manufacturer Part Number: CRCW12061K00FKEAHP; Power: 0.75W; TC: ±100ppm/°C; Voltage: 200V; PressFit: No; Part Number: R1206_1K_1%_0.75W_100PPM_VISHAY_CRCW-HP e3; Component Kind: Standard; Component Type: Standard; Pin Count: 2; Value: 1k; Status: None; Case: 1206; Mounted: Yes; Sense: No; Socket: No; SMD: Yes; ComponentHeight: 0.65mm; HelpURL: \\cern.ch\dfs\Applications\Altium\Datasheets\R1206_VISHAY_CRCW-HP e3.pdf; Author: CERN DEM JLC; CreateDate: 13.11.2013; LatestRevisionDate: 13.11.2013
R104 = R0805_49K9_0.1%_0.1W_10PPM: Resistor - 0.1%; Part Description: Thin Film Chip Resistor; Manufacturer: GENERIC; Manufacturer1 Part Number: RN73C2A49K9BTG; Power: 0.1W; TC: ±10ppm; PressFit: No; Part Number: R0805_49K9_0.1%_0.1W_10PPM; Component Kind: Standard; Component Type: Standard; Pin Count: 2; Value: 49k9; Status: Not Recommended; Tolerance: ±0.1%; Manufacturer Part Number: R0805_49K9_0.1%_0.1W_10PPM; Case: 0805; Mounted: Yes; Sense: No; Socket: No; SMD: Yes; Manufacturer1 Example: TYCO HOLSWORTHY; Manufacturer1 ComponentHeight: 0.6mm; HelpURL: \\cern.ch\dfs\Applications\Altium\Datasheets\R0805_Tyco_RN73.pdf; Author: CERN DEM JLC; CreateDate: 03.12.2007; LatestRevisionDate: 13.03.2008
R105 = R0805_36K_0.1%_0.125W_25PPM: Resistor - 0.1%; Part Description: Thin Film Chip Resistor; Manufacturer: GENERIC; Manufacturer1 Part Number: ERA6AEB363V; Power: 0.125W; TC: ±25ppm; PressFit: No; Part Number: R0805_36K_0.1%_0.125W_25PPM; Component Kind: Standard; Component Type: Standard; Pin Count: 2; Value: 36k; Status: Not Recommended; Manufacturer Part Number: R0805_36K_0.1%_0.125W_25PPM; Case: 0805; Mounted: Yes; Sense: No; Socket: No; SMD: Yes; Manufacturer1 Example: PANASONIC; Manufacturer1 ComponentHeight: 0.6mm; HelpURL: \\cern.ch\dfs\Applications\Altium\Datasheets\R0805_PANASONIC_ERA.pdf; Author: CERN DEM JLC; CreateDate: 04.06.2015; LatestRevisionDate: 04.06.2015
R106 = R0603_4K87_0.1%_0.063W_10PPM: Resistor - 0.1%; Part Description: Thin Film Chip Resistor; Manufacturer: GENERIC; Manufacturer1 Part Number: RN73C1J4K87BTDF; Power: 0.063W; TC: ±10ppm; PressFit: No; Part Number: R0603_4K87_0.1%_0.063W_10PPM; Component Kind: Standard; Component Type: Standard; Pin Count: 2; Value: 4k87; Status: Not Recommended; Manufacturer Part Number: R0603_4K87_0.1%_0.063W_10PPM; Case: 0603; Mounted: Yes; Sense: No; Socket: No; SMD: Yes; Manufacturer1 Example: TYCO HOLSWORTHY; Manufacturer1 ComponentHeight: 0.5mm; HelpURL: \\cern.ch\dfs\Applications\Altium\Datasheets\R0603_Tyco_RN73.pdf; Author: CERN DEM JLC; CreateDate: 03.12.2007; LatestRevisionDate: 13.03.2008
R112 = R0805_750K_1%_0.125W_100PPM: Resistor - 1%; Part Description: General Purpose Thick Film Chip Resistor; Manufacturer: GENERIC; Manufacturer1 Part Number: NRC10F7503TRF; Power: 0.125W; TC: ±100ppm/°C; PressFit: No; Part Number: R0805_750K_1%_0.125W_100PPM; Component Kind: Standard; Component Type: Standard; Pin Count: 2; Value: 750k; Status: Preferred; Manufacturer Part Number: R0805_750K_1%_0.125W_100PPM; Case: 0805; Mounted: Yes; Sense: No; Socket: No; SMD: Yes; Manufacturer1 Example: NIC COMPONENT; Manufacturer1 ComponentHeight: 0.6mm; HelpURL: \\cern.ch\dfs\Applications\Altium\Datasheets\R0805_NIC_NRC.pdf; Author: CERN DEM JLC; CreateDate: 03.12.2007; LatestRevisionDate: 13.03.2008
T1-T9 T21-T27 = BSS138LT1G: N-CHANNEL MOSFET WITH DIODE; Part Description: 50V, 200mA N-Channel Enhancement Mode Field-Effect Transistor; Manufacturer: ON SEMICONDUCTOR; PressFit: No; Bonding: No; Part Number: BSS138LT1G; Component Kind: Standard; Component Type: Standard; Device: BSS138LT1G; PackageDescription: SOT23, 0.95mm Pitch; 3 Pin, 1.40mm W X 3.00mm L X 1.10mm H body, IPC Medium Density; Manufacturer Part Number: BSS138L; Pin Count: 3; Case: SOT23-3; Mounted: Yes; Socket: No; SMD: Yes; Sense: No; ComponentHeight: 1.11mm; HelpURL: \\cern.ch\dfs\Applications\Altium\Datasheets\BSS138LT1G.pdf; Author: CERN DEM JLC; CreateDate: 23.03.2009; LatestRevisionDate: 25.05.2022
T16 T17 = BC857B: PNP Transistor; Part Description: -45V -100mA PNP General-Purpose Transistors; Manufacturer: NXP SEMICONDUCTORS; PressFit: No; Bonding: No; Part Number: BC857B; Component Kind: Standard; Component Type: Standard; Device: BC857B; PackageDescription: SOT23, 0.95mm Pitch; 3 Pin, 1.30mm W X 2.90mm L X 1.10mm H body, IPC Medium Density; Manufacturer Part Number: BC857B; Pin Count: 3; Case: SOT23-3; Mounted: Yes; Socket: No; SMD: Yes; Sense: No; ComponentHeight: 1.1mm; HelpURL: \\cern.ch\dfs\Applications\Altium\Datasheets\BC857B.pdf; Author: CERN DEM JLC; CreateDate: 14.06.2011; LatestRevisionDate: 14.06.2011
T31 T32 = BC847B: NPN Transistor; Part Description: 45V 100mA NPN General-Purpose Transistor; Manufacturer: NXP SEMICONDUCTORS; PressFit: No; Bonding: No; Part Number: BC847B; Component Kind: Standard; Component Type: Standard; Device: BC847B; PackageDescription: SOT23, 0.95mm Pitch; 3 Pin, 1.30mm W X 2.90mm L X 1.10mm H body, IPC Medium Density; Manufacturer Part Number: BC847B; Pin Count: 3; Case: SOT23-3; Mounted: Yes; Socket: No; SMD: Yes; Sense: No; ComponentHeight: 1.1mm; HelpURL: \\cern.ch\dfs\Applications\Altium\Datasheets\BC847B.pdf; Author: CERN DEM JLC; CreateDate: 14.06.2011; LatestRevisionDate: 14.06.2011
IC3 IC5 = LT8362IDD#TRPBF: Manufacturer Part Number: LT8362IDD#TRPBF